# Altium project Controller_AC.PrjPcb
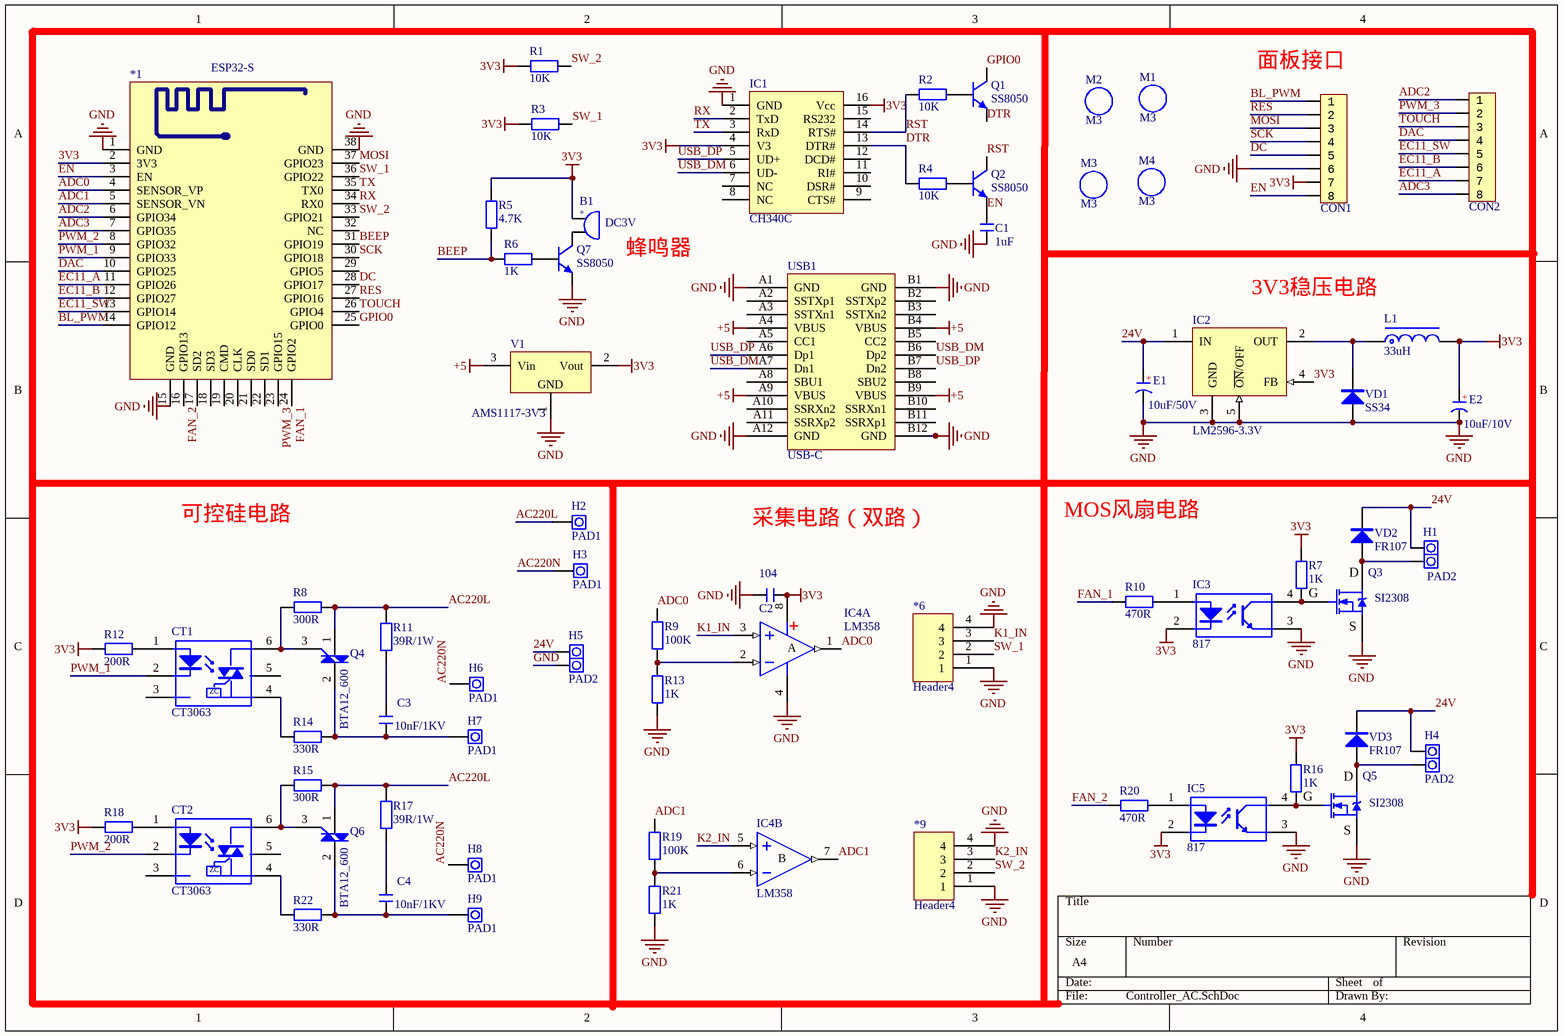
[diagram p0: Controller_AC.SchDoc]
1 sheet, 67 parts. Net scope: global (net labels, ports and power ports of the same name join across sheets).
Board file: Controller_AC.PcbDoc

## Sheet Controller_AC.SchDoc
size A4

### Parts
*1  ESP32-S  [WIFIM-SMD_ESP32-C3S-2M]
*6  Header4  [HDR2.54-LI-4P]
*9  Header4  [HDR2.54-LI-4P]
B1  DC3V  [BEEP 5x9x5.5]
C1  1uF  [C 0603]
C2  104  [C 0603]
C3  10nF/1KV  [C 1206_L]
C4  10nF/1KV  [C 1206_L]
CON1  FFC_0.5_8  [FFC_0.5_8]  (value not drawn)
CON2  FFC_0.5_8  [FFC_0.5_8]  (value not drawn)
CT1  CT3063  [SMD-6-CT3063]
CT2  CT3063  [SMD-6-CT3063]
E1  10uF/50V  [CT 6*6 - C]
E2  10uF/10V  [CT 6*6 - C]
H1  PAD2  [PAD2-2.0]
H2  PAD1  [PAD1-C]
H3  PAD1  [PAD1-B]
H4  PAD2  [PAD2-2.0]
H5  PAD2  [PAD2-5.08]
H6  PAD1  [PAD1-C]
H7  PAD1  [PAD1-C]
H8  PAD1  [PAD1-C]
H9  PAD1  [PAD1-C]
IC1  CH340C  [SOP16_N]
IC2  LM2596-3.3V  [TO263-5A]
IC3  817  [SOP4-W2.54_L]
IC4  LM358  [SOP8_N]  (parts A,B of 2)
IC5  817  [SOP4-W2.54_L]
L1  33uH  [CDRH127]
M1  M3  [M3 125X200]
M2  M3  [M3 125X200]
M3  M3  [M3 125X200]
M4  M3  [M3 125X200]
Q1  SS8050  [SOT23-3N]
Q2  SS8050  [SOT23-3N]
Q3  SI2308  [SOT23-3N]
Q4  BTA12_600  [TO220A]
Q5  SI2308  [SOT23-3N]
Q6  BTA12_600  [TO220A]
Q7  SS8050  [SOT23-3N]
R1  10K  [R 0603]
R2  10K  [R 0603]
R3  10K  [R 0603]
R4  10K  [R 0603]
R5  4.7K  [R 0603]
R6  1K  [R 0603]
R7  1K  [R 0603]
R8  300R  [R 0603]
R9  100K  [R 0603]
R10  470R  [R 0603]
R11  39R/1W  [R 2512_L]
R12  200R  [R 0603]
R13  1K  [R 0603]
R14  330R  [R 0603]
R15  300R  [R 0603]
R16  1K  [R 0603]
R17  39R/1W  [R 2512_L]
R18  200R  [R 0603]
R19  100K  [R 0603]
R20  470R  [R 0603]
R21  1K  [R 0603]
R22  330R  [R 0603]
USB1  USB-C  [USB Type-C-16Pin_A]
V1  AMS1117-3V3  [SOT223_L]
VD1  SS34  [SMA]
VD2  FR107  [SMA]
VD3  FR107  [SMA]

### Nets
3V3: *1.2(3V3) B1.1 C2.2 CON1.7 E2.1(A) IC1.4(V3) IC1.16(Vcc) IC2.4(FB) IC3.2(K) IC4.8(V+) IC5.2(K) L1.2 R1.1 R3.2 R5.2 R7.2 R12.1 R16.2 R18.1 V1.2(Vout)
+5: USB1.A4(VBUS) USB1.A9(VBUS) USB1.B4(VBUS) USB1.B9(VBUS) V1.3(Vin)
GND: *1.1(GND) *1.15(GND) *1.38(GND) *6.1 *6.4 *9.1 *9.4 C1.1 C2.1 CON1.6 E1.2(K) E2.2(K) H5.2 IC1.1(GND) IC2.3(GND) IC2.5(~{ON}/OFF) IC3.3(E) IC4.4(V-) IC5.3(E) Q3.2(S) Q5.2(S) Q7.2(E) R13.1 R21.1 USB1.A1(GND) USB1.A12(GND) USB1.B1(GND) USB1.B12(GND) V1.1(GND) VD1.1(A)
24V: E1.1(A) H1.1 H4.1 H5.1 IC2.1(IN) VD2.2(K) VD3.2(K)
AC220L: H2.1 Q4.1(A1) Q6.1(A1) R8.2 R11.2 R15.2 R17.2
AC220N: H3.1 H6.1 H8.1
ADC0: *1.4(SENSOR_VP) IC4.1(OUT) R9.2
ADC1: *1.5(SENSOR_VN) IC4.7(OUT) R19.2
ADC2: *1.6(GPIO34) CON2.1
ADC3: *1.7(GPIO35) CON2.8
BEEP: *1.31(GPIO19) R5.1 R6.1
BL_PWM: *1.14(GPIO12) CON1.1
DAC: *1.10(GPIO25) CON2.4
DC: *1.28(GPIO17) CON1.5
DTR: IC1.13(DTR#) Q1.2(E) R4.1
EC11_A: *1.11(GPIO26) CON2.7
EC11_B: *1.12(GPIO27) CON2.6
EC11_SW: *1.13(GPIO14) CON2.5
EN: *1.3(EN) C1.2 CON1.8 Q2.2(E)
FAN_1: *1.24(GPIO2) R10.2
FAN_2: *1.16(GPIO13) R20.2
GPIO0: *1.25(GPIO0) Q1.3(C)
K1_IN: *6.3 IC4.3(IN+)
K2_IN: *9.3 IC4.5(IN+)
MOSI: *1.37(GPIO23) CON1.3
PWM_1: *1.9(GPIO33) CT1.2(C)
PWM_2: *1.8(GPIO32) CT2.2(C)
PWM_3: *1.23(GPIO15) CON2.2
RES: *1.27(GPIO16) CON1.2
RST: IC1.14(RTS#) Q2.3(C) R2.1
RX: *1.34(RX0) IC1.2(TxD)
SCK: *1.30(GPIO18) CON1.4
SW_1: *1.36(GPIO22) *6.2 R3.1
SW_2: *1.33(GPIO21) *9.2 R1.2
TOUCH: *1.26(GPIO4) CON2.3
TX: *1.35(TX0) IC1.3(RxD)
USB_DM: IC1.6(UD-) USB1.A7(Dn1) USB1.B6(Dp2)
USB_DP: IC1.5(UD+) USB1.A6(Dp1) USB1.B7(Dn2)
NetB1_2: B1.2 Q7.3(C)
NetC3_1: C3.1 H7.1 Q4.2(A2) R14.2
NetC3_2: C3.2 R11.1
NetC4_1: C4.1 H9.1 Q6.2(A2) R22.2
NetC4_2: C4.2 R17.1
NetCT1_1: CT1.1(A) R12.2
NetCT1_4: CT1.4(MT2) R14.1
NetCT1_6: CT1.6(MT1) Q4.3(G) R8.1
NetCT2_1: CT2.1(A) R18.2
NetCT2_4: CT2.4(MT2) R22.1
NetCT2_6: CT2.6(MT1) Q6.3(G) R15.1
NetH1_2: H1.2 Q3.3(D) VD2.1(A)
NetH4_2: H4.2 Q5.3(D) VD3.1(A)
NetIC2_2: IC2.2(OUT) L1.1 VD1.2(K)
NetIC3_1: IC3.1(A) R10.1
NetIC3_4: IC3.4(C) Q3.1(G) R7.1
NetIC4_2: IC4.2(IN-) R9.1 R13.2
NetIC4_6: IC4.6(IN-) R19.1 R21.2
NetIC5_1: IC5.1(A) R20.1
NetIC5_4: IC5.4(C) Q5.1(G) R16.1
NetQ1_1: Q1.1(B) R2.2
NetQ2_1: Q2.1(B) R4.2
NetQ7_1: Q7.1(B) R6.2

Not connected (* = marked no-connect by the designer): *1 17(SD2) 18(SD3) 19(CMD) 20(CLK) 21(SD0) 22(SD1) 29(GPIO5) 32(NC); CT1 3(NC) 5(NC); CT2 3(NC) 5(NC); IC1 7(NC) 8(NC) 9(CTS#) 10(DSR#) 11(RI#) 12(DCD#) 15(RS232); USB1 A2(SSTXp1) A3(SSTXn1) A5(CC1) A8(SBU1) A10(SSRXn2) A11(SSRXp2) B2(SSTXp2) B3(SSTXn2) B5(CC2) B8(SBU2) B10(SSRXn1) B11(SSRXp1)

### Notes on the sheet
- (near CON1) 面板接口
- 蜂鸣器
- (near IC2) 3V3稳压电路
- MOS风扇电路
- 可控硅电路
- 采集电路（双路）
- (in symbol BEEP) +
- (in symbol C-CT) +
- (in symbol CT3063) ZC
- (in symbol LM358, part A) A
- (in symbol LM358, part B) B

### Library data of the parts
B1 = BEEP: 蜂鸣器; 版权归属: 源创客; BOM名称: 蜂鸣器; 学习资源: www.ooocke.com
C1-C4 = C: 无极性贴片电容; 版权归属: 源创客; BOM名称: 无极性贴片电容; 学习资源: www.ooocke.com
CON1 CON2 = FFC_0.5_8: FFC; System: Connector
CT1 CT2 = CT3063: 线性光耦（过零检测）; BOM名称: 线性光耦; 版权归属: 源创客; 学习资源: www.ooocke.com
E1 E2 = C-CT: 贴片固态电容; 版权归属: 源创客; BOM名称: 贴片固态电容; 学习资源: www.ooocke.com
H1 H4 H5 = PAD2: 引线焊盘; BOM名称: 引线焊盘
H2 H3 H6-H9 = PAD1: 引线焊盘; BOM名称: 引线焊盘
IC1 = CH340C: 串口转USB; BOM名称: 串口转USB
IC2 = LM2596: DC降压芯片; BOM名称: DC稳压芯片; 版权归属: 源创客; 学习资源: www.ooocke.com
IC3 IC5 = 817: 线性光耦; 版权归属: 源创客; BOM名称: 线性光耦; 学习资源: www.ooocke.com
IC4 = LM358: 双路运放
L1 = L-CDRH: 功率屏蔽电感; 版权归属: 源创客; BOM名称: 功率屏蔽电感; 学习资源: www.ooocke.com
M1-M4 = M3: 铜柱孔; BOM名称: 铜柱孔
Q1 Q2 Q7 = 8050-SMD: 高频放大-NPN型; 版权归属: 源创客; 属性: 40V 1.5A 1W 100MHZ; BOM名称: 高频放大-NPN型; 学习资源: www.ooocke.com
Q3 Q5 = SI2302: N沟道场效应管; 版权归属: 源创客; BOM名称: N沟道场效应管; 学习资源: www.ooocke.com
Q4 Q6 = BTA12_600: 双向可控硅; 版权归属: 源创客; BOM名称: 双向可控硅; 学习资源: www.ooocke.com
R1-R22 = R: 贴片电阻; 版权归属: 源创客; BOM名称: 贴片电阻; 学习资源: www.ooocke.com
USB1 = USB-C/S: USB-C型母接口; BOM名称: USB-C型母接口
V1 = AMS1117: 三端稳压芯片; BOM名称: 稳压芯片; 版权归属: 源创客; 学习资源: www.ooocke.com
VD1-VD3 = SS34: 肖特基二极管; 版权归属: 源创客; 属性: 40V/3A; BOM名称: 肖特基二极管; 学习资源: www.ooocke.com